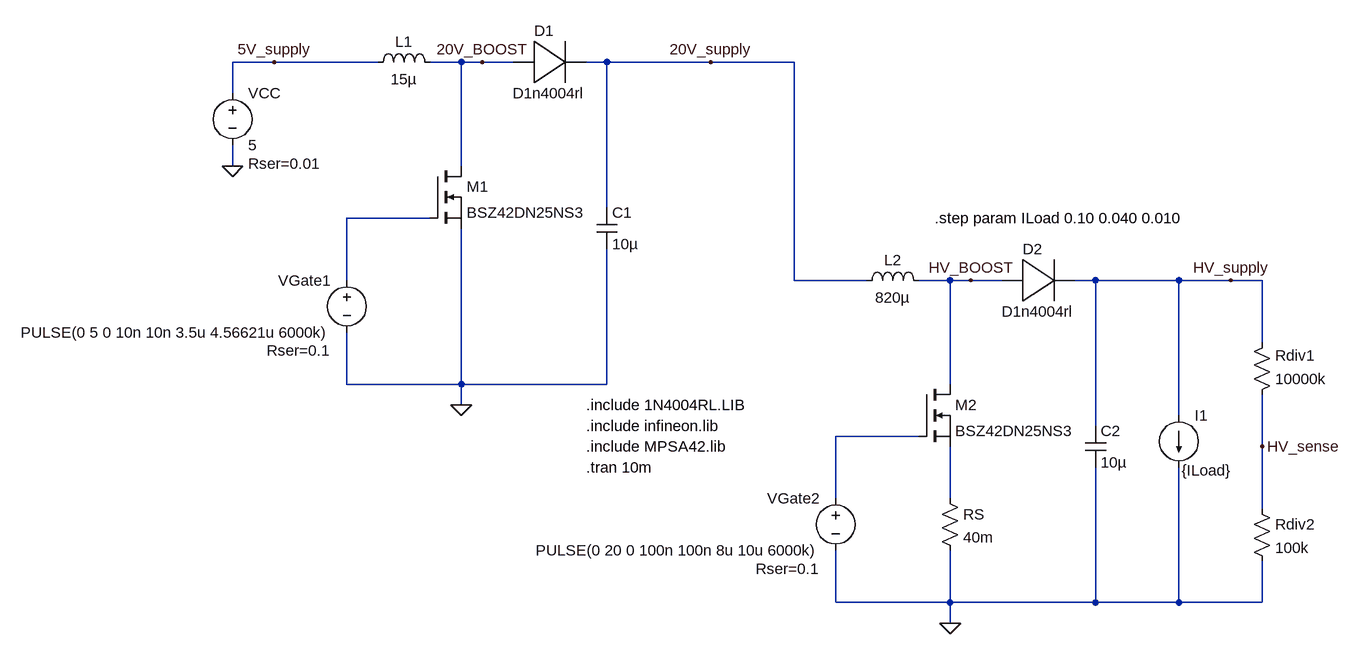
[diagram p0: schematic HV_supply.asc]
HV_supply.asc, the LTspice schematic file:
Version 4
SHEET 1 2032 772
WIRE 144 -112 80 -112
WIRE 304 -112 144 -112
WIRE 432 -112 384 -112
WIRE 464 -112 432 -112
WIRE 512 -112 464 -112
WIRE 656 -112 624 -112
WIRE 816 -112 656 -112
WIRE 944 -112 816 -112
WIRE 80 -64 80 -112
WIRE 80 48 80 16
WIRE 432 48 432 -112
WIRE 656 112 656 -112
WIRE 384 128 256 128
WIRE 256 224 256 128
WIRE 944 224 944 -112
WIRE 1056 224 944 224
WIRE 1184 224 1136 224
WIRE 1216 224 1184 224
WIRE 1264 224 1216 224
WIRE 1408 224 1376 224
WIRE 1536 224 1408 224
WIRE 1616 224 1536 224
WIRE 1664 224 1616 224
WIRE 1664 320 1664 224
WIRE 256 384 256 304
WIRE 432 384 432 144
WIRE 432 384 256 384
WIRE 656 384 656 176
WIRE 656 384 432 384
WIRE 1184 384 1184 224
WIRE 432 416 432 384
WIRE 1536 432 1536 224
WIRE 1408 448 1408 224
WIRE 1136 464 1008 464
WIRE 1664 480 1664 400
WIRE 1008 560 1008 464
WIRE 1184 560 1184 480
WIRE 1664 576 1664 480
WIRE 1008 720 1008 640
WIRE 1184 720 1184 640
WIRE 1184 720 1008 720
WIRE 1408 720 1408 512
WIRE 1408 720 1184 720
WIRE 1536 720 1536 512
WIRE 1536 720 1408 720
WIRE 1664 720 1664 656
WIRE 1664 720 1536 720
WIRE 1184 752 1184 720
FLAG 432 416 0
FLAG 144 -112 5V_supply
FLAG 464 -112 20V_BOOST
FLAG 816 -112 20V_supply
FLAG 1664 480 HV_sense
FLAG 80 48 0
FLAG 1184 752 0
FLAG 1216 224 HV_BOOST
FLAG 1616 224 HV_supply
SYMBOL voltage 256 208 M0
WINDOW 123 0 0 Left 0
WINDOW 39 24 124 Left 2
SYMATTR SpiceLine Rser=0.1
SYMATTR InstName VGate1
SYMATTR Value PULSE(0 5 0 10n 10n 3.5u 4.56621u 6000k)
SYMBOL res 1648 416 M180
WINDOW 0 36 76 Left 2
WINDOW 3 36 40 Left 2
SYMATTR InstName Rdiv1
SYMATTR Value 10000k
SYMBOL res 1648 560 R0
SYMATTR InstName Rdiv2
SYMATTR Value 100k
SYMBOL voltage 80 -80 R0
WINDOW 123 0 0 Left 0
WINDOW 39 24 124 Left 2
SYMATTR SpiceLine Rser=0.01
SYMATTR InstName VCC
SYMATTR Value 5
SYMBOL ind 288 -96 R270
WINDOW 0 32 56 VTop 2
WINDOW 3 5 56 VBottom 2
SYMATTR InstName L1
SYMATTR Value 15µ
SYMATTR SpiceLine Ipk=2.5 Rser=0.075 Rpar=77244 Cpar=0
SYMBOL cap 640 112 R0
SYMATTR InstName C1
SYMATTR Value 10µ
SYMATTR SpiceLine V=250
SYMBOL ind 1040 240 R270
WINDOW 0 32 56 VTop 2
WINDOW 3 5 56 VBottom 2
SYMATTR InstName L2
SYMATTR Value 820µ
SYMATTR SpiceLine Ipk=1.6 Rser=0.64 Rpar=77244 Cpar=0 mfg="Coilcraft" pn="MSS1583-824"
SYMBOL 1N4004RL 544 -112 R0
SYMATTR InstName D1
SYMBOL nmos 384 48 R0
SYMATTR InstName M1
SYMATTR Value BSZ42DN25NS3
SYMBOL voltage 1008 544 M0
WINDOW 123 0 0 Left 0
WINDOW 39 24 124 Left 2
SYMATTR SpiceLine Rser=0.1
SYMATTR InstName VGate2
SYMATTR Value PULSE(0 20 0 100n 100n 8u 10u 6000k)
SYMBOL cap 1392 448 R0
SYMATTR InstName C2
SYMATTR Value 10µ
SYMATTR SpiceLine V=250
SYMBOL 1N4004RL 1296 224 R0
SYMATTR InstName D2
SYMBOL nmos 1136 384 R0
SYMATTR InstName M2
SYMATTR Value BSZ42DN25NS3
SYMBOL res 1168 544 R0
SYMATTR InstName RS
SYMATTR Value 40m
SYMBOL load2 1536 432 R0
WINDOW 3 4 85 Left 2
SYMATTR InstName I1
SYMATTR Value {ILoad}
TEXT 624 512 Left 2 !.tran 10m
TEXT 624 416 Left 2 !.include 1N4004RL.LIB
TEXT 624 448 Left 2 !.include infineon.lib
TEXT 624 480 Left 2 !.include MPSA42.lib
TEXT 1160 128 Left 2 !.step param ILoad 0.10 0.040 0.010

The netlist it stands for:
* HV_supply.asc
VGate1 N001 0 PULSE(0 5 0 10n 10n 3.5u 4.56621u 6000k) Rser=0.1
Rdiv1 HV_sense HV_supply 10000k
Rdiv2 HV_sense 0 100k
VCC 5V_supply 0 5 Rser=0.01
L1 5V_supply 20V_BOOST 15µ Ipk=2.5 Rser=0.075 Rpar=77244 Cpar=0
C1 20V_supply 0 10µ V=250
L2 20V_supply HV_BOOST 820µ Ipk=1.6 Rser=0.64 Rpar=77244 Cpar=0 mfg="Coilcraft" pn="MSS1583-824"
D1 20V_BOOST 20V_supply D1n4004rl
M1 20V_BOOST N001 0 0 BSZ42DN25NS3
VGate2 N002 0 PULSE(0 20 0 100n 100n 8u 10u 6000k) Rser=0.1
C2 HV_supply 0 10µ V=250
D2 HV_BOOST HV_supply D1n4004rl
M2 HV_BOOST N002 N003 N003 BSZ42DN25NS3
RS N003 0 40m
I1 HV_supply 0 {ILoad}
.model D D
.lib standard.dio
.model NMOS NMOS
.model PMOS PMOS
.lib standard.mos
.tran 10m
.include 1N4004RL.LIB
.include infineon.lib
.include MPSA42.lib
.step param ILoad 0.10 0.040 0.010
.lib 1N4004RL.LIB
.backanno
.end